# Altium project SAMV71_Xplained_Ultra.PrjPCB (part 4 of 5)

## Sheet SAMV71_Xplained_Ultra_Shield_Connectors.SchDoc: Shield Connectors
size A3; Organization: ATMEL Norway; Address1: Vestre Rosten 79; Address2: N-7075 TILLER; Address3: NORWAY; DocumentNumber: A09-2407; Revision: 3; SheetNumber: 8; SheetTotal: 13; PageSetup: Record=PageOptions|CenterHorizontal=True|CenterVertical=True|PrintScale=1.01|XCorrection=1.00|YCorrection=1.00|PrintKind=1|BorderSize=5000000|LeftOffset=0|BottomOffset=0|Orientation=2|PaperLength=1000|PaperWidth=1000|Scale=100|PaperSource=7|PrintQuality=-4|MediaType=1|DitherType=10|PaperKind=A3 (297 x 420 mm)|PrintScaleMode=1
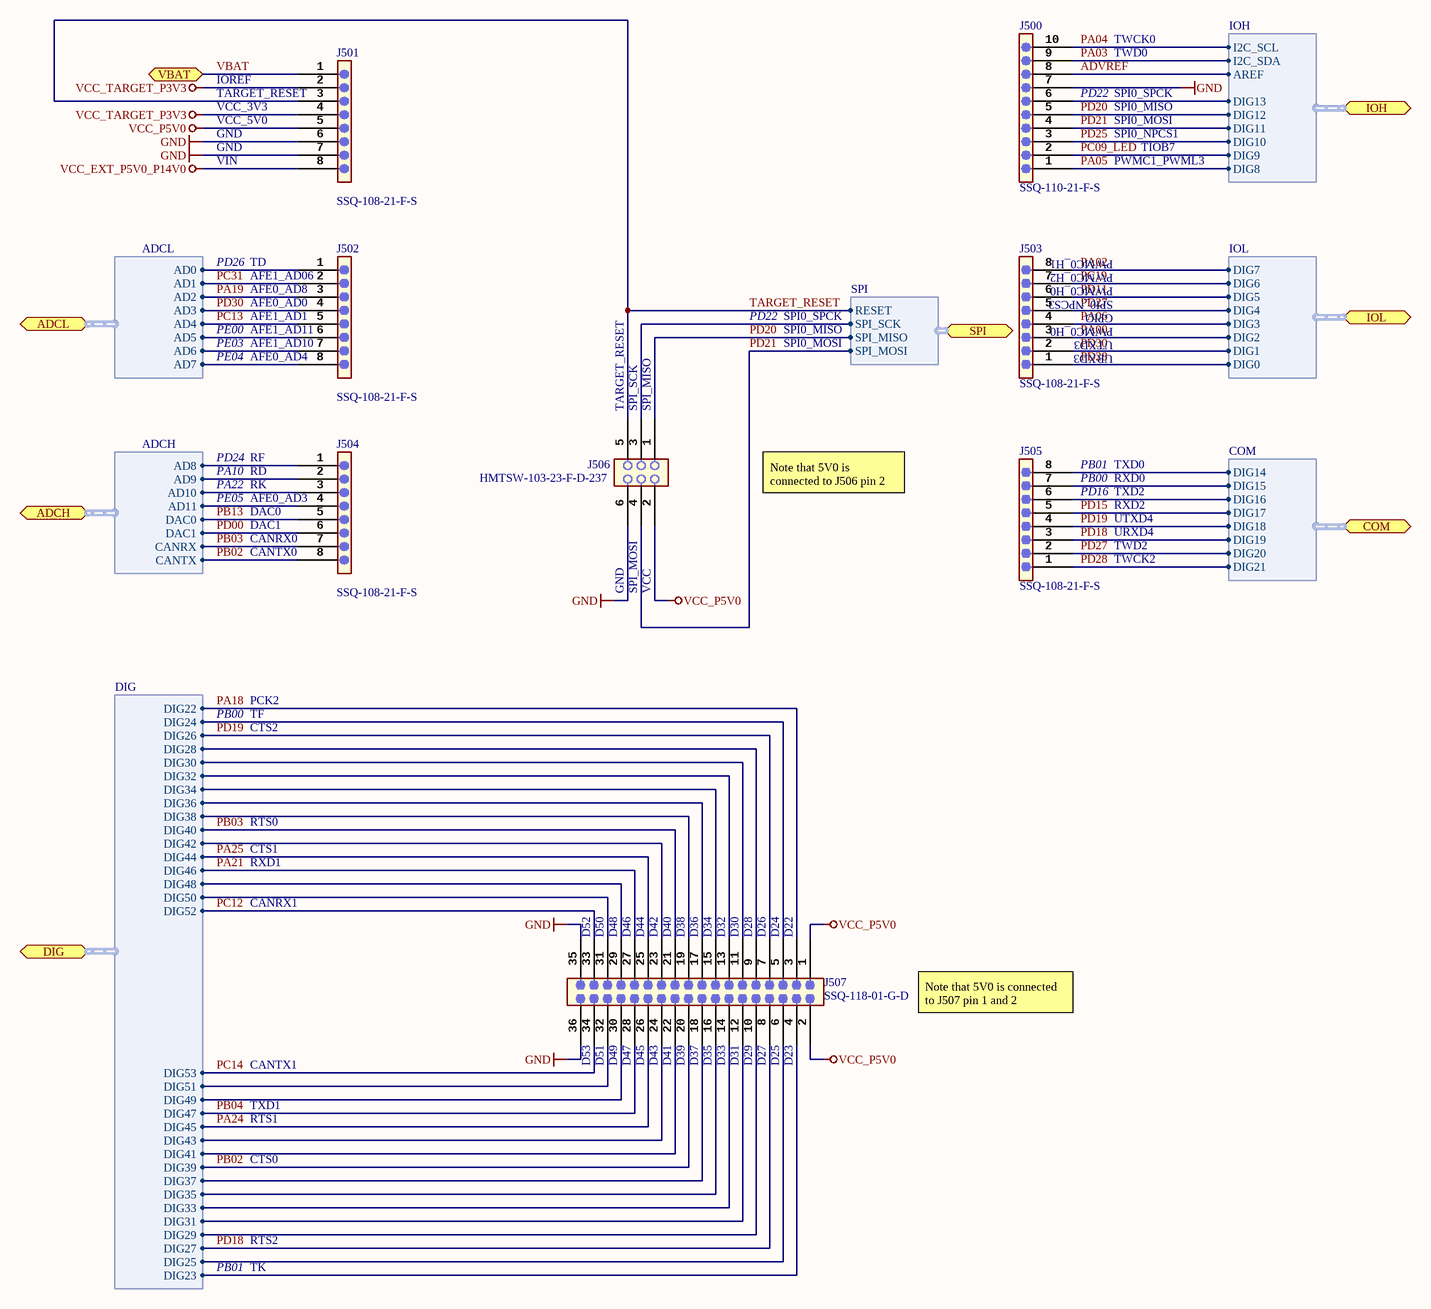
[diagram p9: SAMV71_Xplained_Ultra_Shield_Connectors.SchDoc]

### Parts
J500  value SSQ-110-21-F-S  [AP8-00822]
J501  value SSQ-108-21-F-S  [AP8-00823]
J502  value SSQ-108-21-F-S  [AP8-00823]
J503  value SSQ-108-21-F-S  [AP8-00823]
J504  value SSQ-108-21-F-S  [AP8-00823]
J505  value SSQ-108-21-F-S  [AP8-00823]
J506  value HMTSW-103-23-F-D-237  [AP8-00182]
J507  value SSQ-118-01-G-D  [AP8-00259]

### Ports
ADCH (harness ADCH), ADCL (harness ADCL), COM (harness COM), DIG (harness DIG), IOH (harness IOH), IOL (harness IOL), SPI (harness SPI), VBAT (bidir)

### Harnesses
IOH: DIG8, DIG9, DIG10, DIG11, DIG12, DIG13, AREF, I2C_SCL, I2C_SDA
IOL: DIG0, DIG1, DIG2, DIG3, DIG4, DIG5, DIG6, DIG7
COM: DIG14, DIG15, DIG16, DIG17, DIG18, DIG19, DIG20, DIG21
ADCL: AD0, AD1, AD2, AD3, AD4, AD5, AD6, AD7
ADCH: AD8, AD9, AD10, AD11, DAC0, DAC1, CANRX, CANTX
DIG: DIG22, DIG23, DIG24, DIG25, DIG26, DIG27, DIG28, DIG29, DIG30, DIG31, DIG32, DIG33, DIG34, DIG35, DIG36, DIG37, DIG38, DIG39, DIG40, DIG41, DIG42, DIG43, DIG44, DIG45, DIG46, DIG47, DIG48, DIG49, DIG50, DIG51, DIG52, DIG53
SPI: SPI_MISO, SPI_MOSI, SPI_SCK, RESET

### Nets
GND: J500.7 J501.6 J501.7 J506.6 J507.35 J507.36
VCC_EXT_P5V0_P14V0: J501.8
VCC_P5V0: J501.5 J506.2 J507.1 J507.2
VCC_TARGET_P3V3: J501.2 J501.4
ADVREF: J500.8 ; port IOH.AREF
PA00: J503.3 ; port IOL.DIG2
PA02: J503.8 ; port IOL.DIG7
PA03: J500.9 ; port IOH.I2C_SDA
PA04: J500.10 ; port IOH.I2C_SCL
PA05: J500.1 ; port IOH.DIG8
PA06: J503.4 ; port IOL.DIG3
PA18: J507.3 ; port DIG.DIG22
PA19: J502.3 ; port ADCL.AD2
PA21: J507.27 ; port DIG.DIG46
PA24: J507.26 ; port DIG.DIG45
PA25: J507.25 ; port DIG.DIG44
PB02: J504.8 J507.20 ; port ADCH.CANTX, port DIG.DIG39
PB03: J504.7 J507.21 ; port ADCH.CANRX, port DIG.DIG40
PB04: J507.28 ; port DIG.DIG47
PB13: J504.5 ; port ADCH.DAC0
PC09_LED: J500.2 ; port IOH.DIG9
PC12: J507.33 ; port DIG.DIG52
PC13: J502.5 ; port ADCL.AD4
PC14: J507.34 ; port DIG.DIG53
PC19: J503.7 ; port IOL.DIG6
PC31: J502.2 ; port ADCL.AD1
PD00: J504.6 ; port ADCH.DAC1
PD11: J503.6 ; port IOL.DIG5
PD15: J505.5 ; port COM.DIG17
PD18: J505.3 J507.8 ; port COM.DIG19, port DIG.DIG27
PD19: J505.4 J507.7 ; port COM.DIG18, port DIG.DIG26
PD20: J500.5 J506.1 ; port IOH.DIG12, port SPI.SPI_MISO
PD21: J500.4 J506.4 ; port IOH.DIG11, port SPI.SPI_MOSI
PD25: J500.3 ; port IOH.DIG10
PD27: J503.5 J505.2 ; port IOL.DIG4, port COM.DIG20
PD28: J503.1 J505.1 ; port IOL.DIG0, port COM.DIG21
PD30: J502.4 J503.2 ; port IOL.DIG1, port ADCL.AD3
TARGET_RESET: J501.3 J506.5 ; port SPI.RESET
VBAT: J501.1 ; port VBAT
NetJ500_6: J500.6 ; port IOH.DIG13
NetJ502_1: J502.1 ; port ADCL.AD0
NetJ502_6: J502.6 ; port ADCL.AD5
NetJ502_7: J502.7 ; port ADCL.AD6
NetJ502_8: J502.8 ; port ADCL.AD7
NetJ504_1: J504.1 ; port ADCH.AD8
NetJ504_2: J504.2 ; port ADCH.AD9
NetJ504_3: J504.3 ; port ADCH.AD10
NetJ504_4: J504.4 ; port ADCH.AD11
NetJ505_6: J505.6 ; port COM.DIG16
NetJ505_7: J505.7 ; port COM.DIG15
NetJ505_8: J505.8 ; port COM.DIG14
NetJ506_3: J506.3 ; port SPI.SPI_SCK
NetJ507_4: J507.4 ; port DIG.DIG23
NetJ507_5: J507.5 ; port DIG.DIG24
NetJ507_6: J507.6 ; port DIG.DIG25
NetJ507_9: J507.9 ; port DIG.DIG28
NetJ507_10: J507.10 ; port DIG.DIG29
NetJ507_11: J507.11 ; port DIG.DIG30
NetJ507_12: J507.12 ; port DIG.DIG31
NetJ507_13: J507.13 ; port DIG.DIG32
NetJ507_14: J507.14 ; port DIG.DIG33
NetJ507_15: J507.15 ; port DIG.DIG34
NetJ507_16: J507.16 ; port DIG.DIG35
NetJ507_17: J507.17 ; port DIG.DIG36
NetJ507_18: J507.18 ; port DIG.DIG37
NetJ507_19: J507.19 ; port DIG.DIG38
NetJ507_22: J507.22 ; port DIG.DIG41
NetJ507_23: J507.23 ; port DIG.DIG42
NetJ507_24: J507.24 ; port DIG.DIG43
NetJ507_29: J507.29 ; port DIG.DIG48
NetJ507_30: J507.30 ; port DIG.DIG49
NetJ507_31: J507.31 ; port DIG.DIG50
NetJ507_32: J507.32 ; port DIG.DIG51

### Notes on the sheet
- TWD0
- TWCK0
- (near J501) TARGET_RESET
- IOREF
- VCC_3V3
- VCC_5V0
- (near J500) PD22
- SPI0_SPCK
- SPI0_MOSI
- SPI0_MISO
- GND
- VIN
- SPI0_NPCS1
- PWMC1_PWML3
- TIOB7
- PD26
- TD
- PWMC0_H2
- PWMC0_H1
- (near J502) AFE0_AD8
- (near J502) AFE1_AD1
- (near J502) AFE0_AD0
- (near J502) AFE1_AD06
- PD22
- SPI0_NPCS3
- PWMC0_H0
- GPIO
- PE00
- PE03
- PE04
- (near J502) AFE1_AD11
- (near J502) AFE1_AD10
- (near J502) AFE0_AD4
- URXD3
- UTXD3
- PD24
- RF
- (near J506) TARGET_RESET
- (near J506) SPI_SCK
- (near J506) SPI_MISO
- PA10
- PA22
- PE05
- DAC0
- DAC1
- RD
- RK
- (near J504) AFE0_AD3
- Note that 5V0 is connected to J506 pin 2
- (near J505) PB01
- (near J505) PB00
- (near J505) PD16
- TXD2
- RXD2
- UTXD4
- URXD4
- TXD0
- RXD0
- (near J504) CANRX0
- (near J504) CANTX0
- SPI_MOSI
- VCC
- TWD2
- TWCK2
- PB00
- PCK2
- TF
- CTS2
- RTS0
- CTS1
- RXD1
- CANRX1
- (near J507) D52
- (near J507) D50
- (near J507) D48
- (near J507) D46
- (near J507) D44
- (near J507) D42
- (near J507) D40
- (near J507) D38
- (near J507) D36
- (near J507) D34
- (near J507) D32
- (near J507) D30
- (near J507) D28
- (near J507) D26
- (near J507) D24
- (near J507) D22
- CANTX1
- (near J507) D53
- (near J507) D51
- (near J507) D49
- (near J507) D47
- (near J507) D45
- (near J507) D43
- (near J507) D41
- (near J507) D39
- (near J507) D37
- (near J507) D35
- (near J507) D33
- (near J507) D31
- (near J507) D29
- (near J507) D27
- (near J507) D25
- (near J507) D23
- Note that 5V0 is connected to J507 pin 1 and 2
- RTS1
- TXD1
- CTS0
- PB01
- TK
- RTS2
- Date:
- PAGE:
- of
- TITLE:
- Document number:
- Revision:

### Library data of the parts
J500 = A08-2026: 1x10 receptacle pin header, low insertion force, 2.54mm pitch THM, Pin in Paste; PartGroup: Mechanical devices,Connectors,Pin header receptacle; Manufacturer: SAMTEC; AN: A08-2026; Height: 8,51000022888184; MPN: SSQ-110-21-F-S
J501-J505 = A08-2025: 1x8 receptacle pin header, low insertion force, 2.54mm pitch THM, Pin in Paste; PartGroup: Mechanical devices,Connectors,Pin header receptacle; Manufacturer: SAMTEC; AN: A08-2025; Height: 8,51000022888184; MPN: SSQ-108-21-F-S
J506 = A08-1654: 2x3 pin header, 2.54mm pitch, Pin-in-Paste THM; PartGroup: Mechanical devices,Connectors,Pin headers; Manufacturer: SAMTEC; TemperatureRange: - 55 ï¿½C to + 125 ï¿½C; AN: A08-1654; Height: 6,09999990463257; MPN: HMTSW-103-23-F-D-237
J507 = A08-0387: 2x18 female pin header, 2.54mm pitch, THM; PartGroup: Mechanical devices,Connectors,Pin header receptacle; Manufacturer: SAMTEC; TemperatureRange: -55 - +125 degC; AN: A08-0387; Height: 8,51000022888184; MPN: SSQ-118-01-G-D